# Altium schematic sheet power_supply.SchDoc
size 420 x 297 mm; Address1: Address1; Address2: Address2; Address3: Address3; Address4: Address4; DocumentNumber: АБВГ.123456.001 Э3; SheetNumber: 2; SheetTotal: 7; Scale: 1:1; DocumentType: Схема электрическая принципиальная; FirstReferrence: АБВГ.123456.001
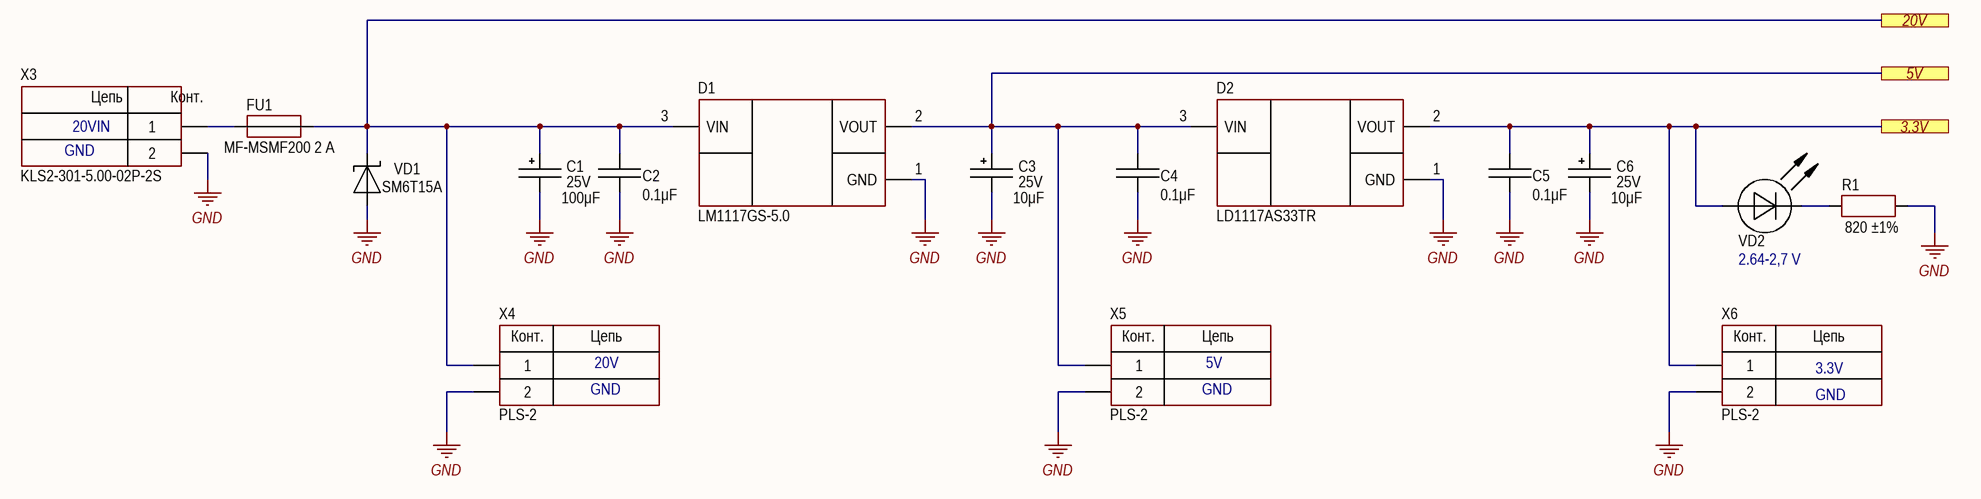
[diagram p0: power_supply.SchDoc]

## Parts
C1  value 100μF  Voltage: 25V  [CAP: D6.3C2.5H11]
C2  value 0.1μF  [CAP: 1206]
C3  value 10μF  Voltage: 25V  [CAP: D6.3C2.5H11]
C4  value 0.1μF  [CAP: 1206]
C5  value 0.1μF  [CAP: 1206]
C6  value 10μF  Voltage: 25V  [CAP: D6.3C2.5H11]
D1  PartNumber: LM1117GS-5.0  [SOT223]  (hidden comment: *)
D2  PartNumber: LD1117AS33TR  [SOT223]  (hidden comment: *)
FU1  PartNumber: MF-MSMF200 2 A  [FUSE: 1812]
R1  value 820  Tolerance: ±1%  [RES: 1206]
VD1  PartNumber: SM6T15A  [DIODE: SMB]
VD2  (no value)  [LED: 1206W]
X3  CommentText: KLS2-301-5.00-02P-2S  [CON: Terminal 2p 5mm]
X4  (no value)  [CON: PLS-2]
X5  (no value)  [CON: PLS-2]
X6  (no value)  [CON: PLS-2]

## Ports
3.3V, 5V, 20V

## Nets
GND: C1.2 C2.1 C3.2 C4.1 C5.1 C6.2 D1.1(GND) D2.1(GND) R1.2 VD1.1(A) X3.2 X4.2 X5.2 X6.2
3.3V: C5.2 C6.1 D2.2(VOUT) VD2.1(A) X6.1 ; port 3.3V
5V: C3.1 C4.2 D1.2(VOUT) D2.3(VIN) X5.1 ; port 5V
20V: C1.1 C2.2 D1.3(VIN) FU1.2 VD1.2(C) X4.1 ; port 20V
NetFU1_1: FU1.1 X3.1
NetR1_1: R1.1 VD2.2(C)

## Notes on the sheet
- GND
- 20VIN
- 2.64-2,7 V
- 20V
- 5V
- 3.3V
- Подп. и дата
- Инв. № дубл.
- Взам. инв. №
- Инв. № подл.
- Изм.
- Лист
- № докум.
- Подп.
- Дата
- 2.106-A3
- Копировал
- Формат А3
- (in symbol PLS-2) Конт.; Цепь
- (in symbol Terminal block 2) Цепь; Конт.

## Library data of the parts
C1 = Aluminium: Manufacturer: Wurth; PartNumber: 860080475013; ValueManufacturerPartNumber: Aluminium capacitor, 100μF, 25V, ±20%, 54mOhm, 14x10x5 mm, -55...+105°C; TypeCapacitor: Aluminium capacitor; Tolerance: ±20%; Impedance: 54mOhm; Package: 14x10x5 mm; HelpURL: https://www.digikey.com/product-detail/en/wurth-electronics-inc/860080475013/732-9029-1-ND/5728972; Temperature: -55...+105°C
C2 C4 C5 = Ceramic_1206: Manufacturer: Murata Electronics; PartNumber: GRM319R71H104K; ValueManufacturerPartNumber: Ceramic capacitor, 0.1μF, X7R, ±10%, 50V, 1206, -55...+125°C; TypeCapacitor: Ceramic capacitor; Tolerance: ±10%; TypeDielectric: X7R; Voltage: 50V; Package: 1206; HelpURL: https://www.chipdip.ru/product/grm319r71h104k; Temperature: -55...+125°C
C3 C6 = Aluminium: Manufacturer: Wurth; PartNumber: 860080475013; ValueManufacturerPartNumber: Aluminium capacitor, 10μF, 25V, ±20%, 54mOhm, 14x10x5 mm, -55...+105°C; TypeCapacitor: Aluminium capacitor; Tolerance: ±20%; Impedance: 54mOhm; Package: 14x10x5 mm; HelpURL: https://www.digikey.com/product-detail/en/wurth-electronics-inc/860080475013/732-9029-1-ND/5728972; Temperature: -55...+105°C
D1 D2 = AMS1117-5.0: Linear voltage regulator; Manufacturer: *; Package: SOT223; ComponentType: Linear voltage regulator; ValueManufacturerPartNumber: *; Temperature: *; VoltageInput: *; MaxDropout: *; CurrentOutput: *; VoltageOutput: *
  D1: HelpURL: https://www.chipdip.ru/product/lm1117gs-5.0
  D2: HelpURL: https://www.chipdip.ru/product/ld1117as33tr
FU1 = FUSE: Manufacturer: Bourns; ValueManufacturerPartNumber: 2 A,  1812, -40...85; Value: 2 A; Package: 1812; HelpURL: https://www.chipdip.ru/product/mf-msmf200-2-a-1812; Temperature: -40...85
R1 = Resistor_1206: Manufacturer: Yageo; PartNumber: RC1206JR-07100RL; ValueManufacturerPartNumber: Resistor film, 820, ±1%, 1206, 0.25W, -55...+125°C; TypeResistor: Resistor film; Power: 0.25W; Package: 1206; HelpURL: https://www.chipdip.ru/product0/9000079905; Temperature: -55...+125°C
VD1 = TVS_single_unidir: Manufacturer: ST Microelectronics; TypeDiode: ESD protection diode; PeakPulseCurrent: 147A(8/20 us); PeakPulsePower: 600W; BreakdownVoltage: 14.3... 15.8 V; ReverseStandoffVoltage: 12.8 V; Package: do-214aa/smb; HelpURL: https://www.chipdip.ru/product/sm6t15a; ValueManufacturerPartNumber: =TypeDiode+', '+ReverseStandoffVoltage+', '+PeakPulsePower+', ''+Package+', '+Temperature; Temperature: -55…+150
VD2 = LED_single: ValueManufacturerPartNumber: LED, Green, *, *, *, -55...+150°C; TypeDiode: LED; ColorParameter: Green; Manufacturer: *; Package: *; HelpURL: *; Temperature: -55...+150°C; Current: *; VoltageDrop: *; PartNumber: *
X3 = Terminal block 2: ValueManufacturerPartNumber: Connector, 2pin, *, *, *; TypeConnector: Connector; Multichannel: 2pin; Manufacturer: *; HelpURL: *; PartNumber: KLS2-301-5.00-02P-2S; VoltageMax: *; Pitch: *; CurrentMax: *
X4-X6 = PLS-2: Manufacturer: Connfly; ValueManufacturerPartNumber: Connector, 2pin, 2.54mm, 500VAC, 3A; TypeConnector: Connector; VoltageMax: 500VAC; Pitch: 2.54mm; CurrentMax: 3A; Multichannel: 2pin; HelpURL: https://www.chipdip.ru/product/pls-2; PartNumber: PLS-2; CommentText: PLS-2